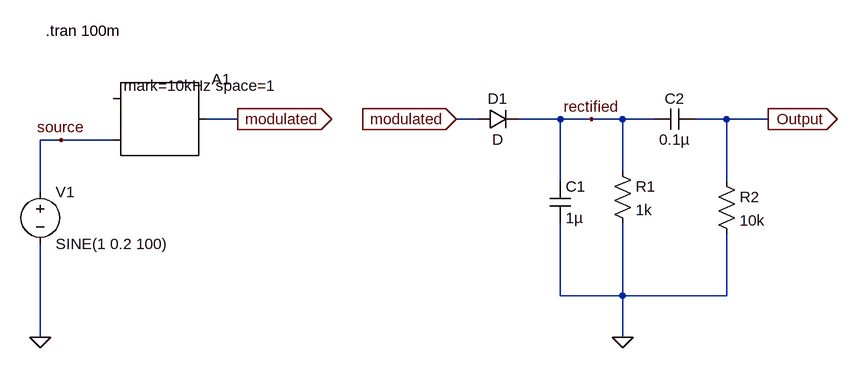
[diagram p0: schematic AM変調と包絡線検波回路.asc]
AM変調と包絡線検波回路.asc, the LTspice schematic file:
Version 4
SHEET 1 956 680
WIRE 0 32 -48 32
WIRE 368 32 336 32
WIRE 496 32 432 32
WIRE 544 32 496 32
WIRE 592 32 544 32
WIRE 640 32 592 32
WIRE 752 32 704 32
WIRE 816 32 752 32
WIRE -272 64 -304 64
WIRE -192 64 -272 64
WIRE 592 112 592 32
WIRE 496 128 496 32
WIRE 752 128 752 32
WIRE -304 144 -304 64
WIRE 496 304 496 192
WIRE 592 304 592 192
WIRE 592 304 496 304
WIRE 752 304 752 208
WIRE 752 304 592 304
WIRE -304 368 -304 224
WIRE 592 368 592 304
FLAG -304 368 0
FLAG 816 32 Output
IOPIN 816 32 Out
FLAG 0 32 modulated
IOPIN 0 32 Out
FLAG 336 32 modulated
IOPIN 336 32 In
FLAG 592 368 0
FLAG 544 32 rectified
FLAG -272 64 source
SYMBOL voltage -304 128 R0
WINDOW 123 24 124 Left 2
WINDOW 39 0 0 Left 0
SYMATTR InstName V1
SYMATTR Value SINE(1 0.2 100)
SYMBOL SpecialFunctions\\modulate -192 0 R0
WINDOW 3 16 -20 Left 2
SYMATTR InstName A1
SYMATTR Value mark=10kHz space=1
SYMBOL diode 368 48 R270
WINDOW 0 32 32 VTop 2
WINDOW 3 0 32 VBottom 2
SYMATTR InstName D1
SYMBOL cap 480 128 R0
SYMATTR InstName C1
SYMATTR Value 1µ
SYMBOL res 576 96 R0
SYMATTR InstName R1
SYMATTR Value 1k
SYMBOL cap 704 16 R90
WINDOW 0 0 32 VBottom 2
WINDOW 3 32 32 VTop 2
SYMATTR InstName C2
SYMATTR Value 0.1µ
SYMBOL res 736 112 R0
SYMATTR InstName R2
SYMATTR Value 10k
TEXT -296 -104 Left 2 !.tran 100m

The netlist it stands for:
* AM変調と包絡線検波回路.asc
V1 source 0 SINE(1 0.2 100)
A1 0 source 0 0 0 0 modulated 0 MODULATOR mark=10kHz space=1
D1 modulated rectified D
C1 rectified 0 1µ
R1 rectified 0 1k
C2 Output rectified 0.1µ
R2 Output 0 10k
.model D D
.lib standard.dio
.tran 100m
.backanno
.end